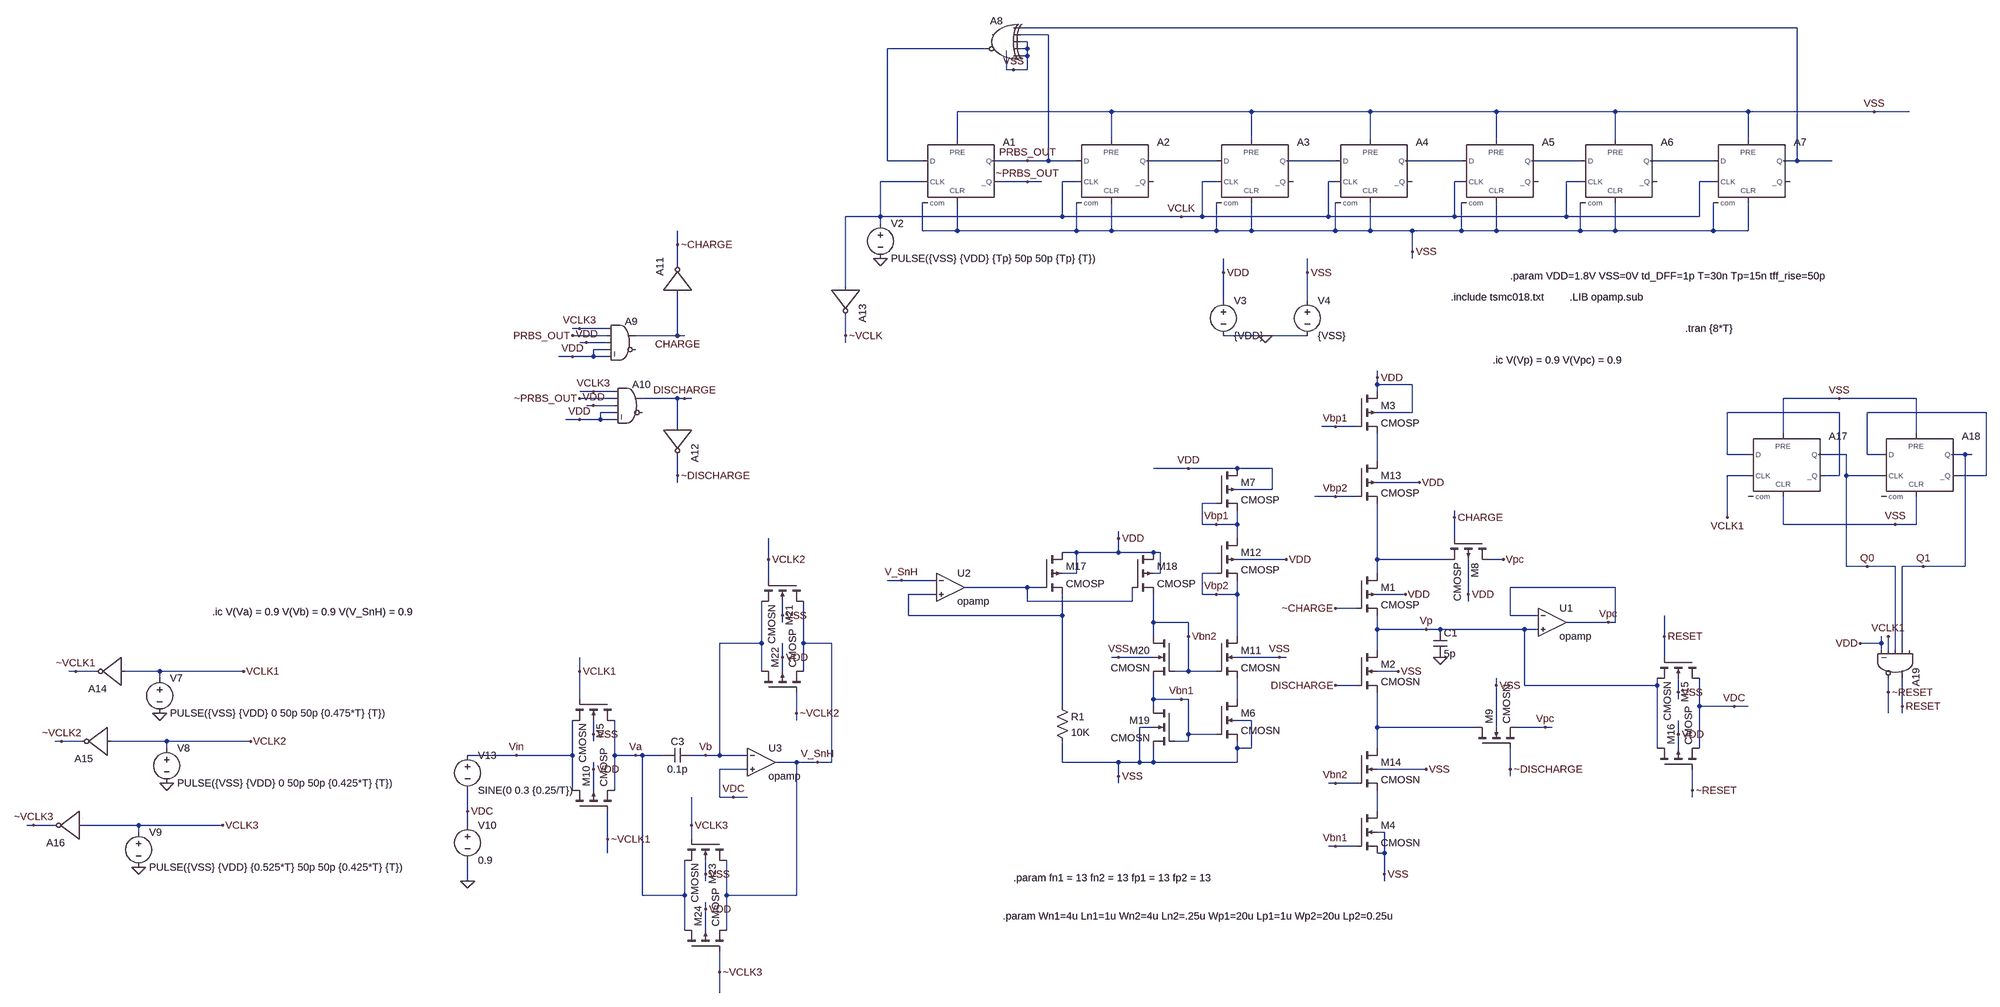
[diagram p0: schematic Current_Mode_Integrator1_2.asc]
Current_Mode_Integrator1_2.asc, the LTspice schematic file:
Version 4
SHEET 1 2280 2092
WIRE 1520 -160 -256 -160
WIRE -192 -144 -256 -144
WIRE -240 -128 -256 -128
WIRE -336 -112 -560 -112
WIRE -240 -112 -240 -128
WIRE -240 -112 -256 -112
WIRE -240 -96 -240 -112
WIRE -240 -96 -256 -96
WIRE -288 -64 -288 -96
WIRE -272 -64 -288 -64
WIRE -240 -64 -240 -96
WIRE -240 -64 -272 -64
WIRE -48 32 -400 32
WIRE 272 32 -48 32
WIRE 544 32 272 32
WIRE 832 32 544 32
WIRE 1104 32 832 32
WIRE 1408 32 1104 32
WIRE 1696 32 1408 32
WIRE 1776 32 1696 32
WIRE -400 96 -400 32
WIRE -48 96 -48 32
WIRE 272 96 272 32
WIRE 544 96 544 32
WIRE 832 96 832 32
WIRE 1104 96 1104 32
WIRE 1408 96 1408 32
WIRE -560 144 -560 -112
WIRE -480 144 -560 144
WIRE -240 144 -320 144
WIRE -192 144 -192 -144
WIRE -192 144 -240 144
WIRE -128 144 -192 144
WIRE 192 144 32 144
WIRE 464 144 352 144
WIRE 752 144 624 144
WIRE 1024 144 912 144
WIRE 1328 144 1184 144
WIRE 1520 144 1520 -160
WIRE 1520 144 1488 144
WIRE 1600 144 1520 144
WIRE -480 192 -576 192
WIRE -240 192 -304 192
WIRE -208 192 -240 192
WIRE -128 192 -160 192
WIRE 192 192 160 192
WIRE 464 192 448 192
WIRE 752 192 736 192
WIRE 1024 192 992 192
WIRE 1328 192 1296 192
WIRE -576 272 -576 192
WIRE -576 272 -656 272
WIRE -160 272 -160 192
WIRE -160 272 -576 272
WIRE 112 272 -160 272
WIRE 160 272 160 192
WIRE 160 272 112 272
WIRE 448 272 448 192
WIRE 448 272 160 272
WIRE 736 272 736 192
WIRE 736 272 448 272
WIRE 992 272 992 192
WIRE 992 272 736 272
WIRE 1296 272 1296 192
WIRE 1296 272 992 272
WIRE -576 288 -576 272
WIRE -480 304 -480 240
WIRE -400 304 -400 240
WIRE -400 304 -480 304
WIRE -128 304 -128 240
WIRE -128 304 -400 304
WIRE -48 304 -48 240
WIRE -48 304 -128 304
WIRE 192 304 192 240
WIRE 192 304 -48 304
WIRE 272 304 272 240
WIRE 272 304 192 304
WIRE 464 304 464 240
WIRE 464 304 272 304
WIRE 544 304 544 240
WIRE 544 304 464 304
WIRE 640 304 544 304
WIRE 752 304 752 240
WIRE 752 304 640 304
WIRE 832 304 832 240
WIRE 832 304 752 304
WIRE 1024 304 1024 240
WIRE 1024 304 832 304
WIRE 1104 304 1104 240
WIRE 1104 304 1024 304
WIRE 1328 304 1328 240
WIRE 1328 304 1104 304
WIRE 1408 304 1408 240
WIRE 1408 304 1328 304
WIRE -1040 336 -1040 304
WIRE 640 352 640 304
WIRE 640 368 640 352
WIRE -1040 384 -1040 336
WIRE 208 400 208 368
WIRE 400 400 400 368
WIRE -656 432 -656 272
WIRE 208 464 208 400
WIRE 400 464 400 400
WIRE -1264 528 -1280 528
WIRE -1200 528 -1264 528
WIRE -1200 544 -1280 544
WIRE -1040 544 -1040 448
WIRE -1040 544 -1136 544
WIRE -1024 544 -1040 544
WIRE -656 544 -656 496
WIRE 304 544 208 544
WIRE 400 544 304 544
WIRE -1248 560 -1264 560
WIRE -1200 560 -1248 560
WIRE -656 560 -656 544
WIRE -1200 576 -1232 576
WIRE -1280 592 -1312 592
WIRE -1232 592 -1232 576
WIRE -1232 592 -1280 592
WIRE -1200 592 -1232 592
WIRE 560 640 560 624
WIRE 560 656 560 640
WIRE 640 656 560 656
WIRE -1232 672 -1264 672
WIRE -1184 672 -1232 672
WIRE 560 672 560 656
WIRE -1184 688 -1264 688
WIRE -1040 688 -1120 688
WIRE -1024 688 -1040 688
WIRE -1008 688 -1024 688
WIRE 1616 688 1488 688
WIRE 1792 688 1616 688
WIRE -1232 704 -1248 704
WIRE -1184 704 -1232 704
WIRE -1184 720 -1216 720
WIRE 640 720 640 656
WIRE 640 720 560 720
WIRE 1616 720 1360 720
WIRE 1952 720 1680 720
WIRE -1264 736 -1296 736
WIRE -1216 736 -1216 720
WIRE -1216 736 -1264 736
WIRE -1184 736 -1216 736
WIRE -1040 752 -1040 688
WIRE 464 752 432 752
WIRE 512 752 464 752
WIRE 1488 768 1488 688
WIRE 1792 768 1792 688
WIRE 1360 816 1360 720
WIRE 1408 816 1360 816
WIRE 1632 816 1568 816
WIRE 1680 816 1680 720
WIRE 1712 816 1680 816
WIRE 1904 816 1872 816
WIRE 1920 816 1904 816
WIRE 560 832 560 768
WIRE 128 848 48 848
WIRE 240 848 128 848
WIRE 320 848 240 848
WIRE -1040 864 -1040 816
WIRE 1408 864 1360 864
WIRE 1616 864 1616 720
WIRE 1616 864 1584 864
WIRE 1632 864 1632 816
WIRE 1712 864 1632 864
WIRE 1952 864 1952 720
WIRE 1952 864 1888 864
WIRE -1040 880 -1040 864
WIRE 656 880 560 880
WIRE 320 896 320 848
WIRE 320 896 240 896
WIRE 464 912 416 912
WIRE 512 912 464 912
WIRE 192 928 160 928
WIRE 736 960 736 944
WIRE 1360 960 1360 864
WIRE 160 976 160 928
WIRE 192 976 160 976
WIRE 240 976 240 944
WIRE 240 976 192 976
WIRE 1488 976 1488 912
WIRE 1744 976 1488 976
WIRE 1792 976 1792 912
WIRE 1792 976 1744 976
WIRE -32 1008 -32 992
WIRE 240 1008 240 976
WIRE 736 1008 736 960
WIRE -128 1040 -160 1040
WIRE -32 1040 -32 1008
WIRE -32 1040 -128 1040
WIRE 48 1040 -32 1040
WIRE 64 1040 48 1040
WIRE -832 1056 -832 1008
WIRE 352 1056 240 1056
WIRE 560 1056 560 928
WIRE 720 1056 560 1056
WIRE 848 1056 816 1056
WIRE 1632 1072 1632 864
WIRE 1680 1072 1632 1072
WIRE 1744 1072 1680 1072
WIRE 1808 1072 1760 1072
WIRE 1904 1072 1904 816
WIRE 1904 1072 1808 1072
WIRE -128 1088 -128 1040
WIRE -128 1088 -160 1088
WIRE 64 1088 64 1040
WIRE 64 1088 48 1088
WIRE 192 1088 160 1088
WIRE 560 1088 560 1056
WIRE -832 1104 -832 1056
WIRE -528 1104 -560 1104
WIRE -448 1104 -528 1104
WIRE -240 1120 -384 1120
WIRE -208 1120 -240 1120
WIRE 1104 1120 864 1120
WIRE -448 1136 -512 1136
WIRE 160 1136 160 1088
WIRE 192 1136 160 1136
WIRE 240 1136 240 1104
WIRE 240 1136 192 1136
WIRE 624 1136 560 1136
WIRE 768 1136 768 1056
WIRE -240 1152 -240 1120
WIRE 0 1152 0 1120
WIRE 0 1152 -240 1152
WIRE 768 1152 768 1136
WIRE 512 1168 464 1168
WIRE -800 1184 -800 1152
WIRE -512 1184 -512 1136
WIRE -160 1184 -160 1136
WIRE -160 1184 -512 1184
WIRE 864 1184 864 1120
WIRE 928 1184 864 1184
WIRE -800 1200 -800 1184
WIRE 48 1200 48 1136
WIRE 128 1200 48 1200
WIRE 1088 1200 992 1200
WIRE 1104 1200 1104 1120
WIRE 1104 1200 1088 1200
WIRE 560 1216 560 1184
WIRE 672 1216 560 1216
WIRE 704 1216 672 1216
WIRE 896 1216 704 1216
WIRE 928 1216 896 1216
WIRE 48 1232 48 1200
WIRE 128 1232 128 1200
WIRE 240 1232 240 1136
WIRE 1216 1232 1216 1184
WIRE -848 1248 -848 1152
WIRE -848 1248 -944 1248
WIRE -752 1248 -752 1152
WIRE -688 1248 -752 1248
WIRE 1712 1248 1712 1232
WIRE 1712 1248 1664 1248
WIRE 560 1264 560 1216
WIRE 1712 1264 1712 1248
WIRE 1728 1264 1728 1232
WIRE 1744 1264 1744 1072
WIRE 1760 1264 1760 1072
WIRE -800 1280 -800 1248
WIRE -32 1280 -48 1280
WIRE 48 1280 -32 1280
WIRE 336 1280 240 1280
WIRE 352 1280 336 1280
WIRE 1216 1280 1216 1232
WIRE -2416 1312 -2432 1312
WIRE -2368 1312 -2416 1312
WIRE -2224 1312 -2304 1312
WIRE -2032 1312 -2224 1312
WIRE -1264 1312 -1264 1280
WIRE -848 1312 -848 1248
WIRE -800 1312 -800 1280
WIRE -752 1312 -752 1248
WIRE 128 1312 128 1232
WIRE 128 1312 96 1312
WIRE 192 1312 128 1312
WIRE 608 1312 560 1312
WIRE -2224 1328 -2224 1312
WIRE 512 1344 464 1344
WIRE 832 1344 832 1328
WIRE 896 1344 896 1216
WIRE 1200 1344 1200 1328
WIRE 1200 1344 896 1344
WIRE 1248 1360 1248 1328
WIRE 1728 1360 1728 1328
WIRE -1264 1376 -1264 1312
WIRE 48 1376 48 1328
WIRE 112 1376 48 1376
WIRE 128 1376 112 1376
WIRE 240 1376 240 1328
WIRE 1248 1376 1248 1360
WIRE -160 1392 -160 1184
WIRE 48 1392 48 1376
WIRE 1296 1392 1296 1328
WIRE 1376 1392 1296 1392
WIRE 1408 1392 1376 1392
WIRE 1760 1392 1760 1328
WIRE -768 1408 -768 1360
WIRE 1728 1408 1728 1360
WIRE 1760 1408 1760 1392
WIRE -768 1424 -768 1408
WIRE 272 1424 240 1424
WIRE 48 1440 16 1440
WIRE 560 1440 560 1360
WIRE 784 1440 560 1440
WIRE 832 1440 832 1344
WIRE 944 1440 880 1440
WIRE 960 1440 944 1440
WIRE -1232 1456 -1232 1424
WIRE 128 1456 128 1376
WIRE 192 1456 128 1456
WIRE 1248 1456 1248 1424
WIRE -2448 1472 -2464 1472
WIRE -2400 1472 -2448 1472
WIRE -2208 1472 -2336 1472
WIRE -2016 1472 -2208 1472
WIRE -1232 1472 -1232 1456
WIRE 128 1472 128 1456
WIRE 128 1472 96 1472
WIRE -2208 1488 -2208 1472
WIRE 240 1488 240 1472
WIRE 272 1488 272 1424
WIRE 272 1488 240 1488
WIRE 560 1488 560 1440
WIRE 1200 1488 1200 1344
WIRE 1248 1488 1248 1456
WIRE 1296 1488 1296 1392
WIRE -1408 1504 -1520 1504
WIRE -1280 1504 -1280 1424
WIRE -1280 1504 -1408 1504
WIRE -1184 1504 -1184 1424
WIRE -1136 1504 -1184 1504
WIRE -1120 1504 -1136 1504
WIRE -1072 1504 -1120 1504
WIRE -976 1504 -1008 1504
WIRE -944 1504 -944 1248
WIRE -944 1504 -976 1504
WIRE -880 1504 -944 1504
WIRE -768 1520 -816 1520
WIRE -720 1520 -768 1520
WIRE -688 1520 -688 1248
WIRE -688 1520 -720 1520
WIRE -160 1520 -160 1472
WIRE -32 1520 -160 1520
WIRE 16 1520 16 1440
WIRE 16 1520 -32 1520
WIRE 48 1520 48 1488
WIRE 48 1520 16 1520
WIRE 240 1520 240 1488
WIRE 240 1520 48 1520
WIRE -1232 1536 -1232 1520
WIRE -880 1536 -944 1536
WIRE 672 1536 560 1536
WIRE 864 1536 864 1488
WIRE -32 1552 -32 1520
WIRE 864 1552 864 1536
WIRE -32 1568 -32 1552
WIRE 464 1568 448 1568
WIRE 512 1568 464 1568
WIRE -1280 1584 -1280 1504
WIRE -1232 1584 -1232 1536
WIRE -1184 1584 -1184 1504
WIRE 1280 1584 1280 1536
WIRE -944 1600 -944 1536
WIRE -912 1600 -944 1600
WIRE -880 1600 -912 1600
WIRE 1280 1600 1280 1584
WIRE -1520 1632 -1520 1584
WIRE 560 1632 560 1584
WIRE -2512 1664 -2528 1664
WIRE -2464 1664 -2512 1664
WIRE -2272 1664 -2400 1664
WIRE -2080 1664 -2272 1664
WIRE -1520 1664 -1520 1632
WIRE -1008 1664 -1008 1600
WIRE -2272 1680 -2272 1664
WIRE 576 1680 560 1680
WIRE -1200 1696 -1200 1632
WIRE -1008 1696 -1008 1664
WIRE 464 1712 448 1712
WIRE 512 1712 464 1712
WIRE -1200 1728 -1200 1696
WIRE 576 1728 576 1680
WIRE 576 1728 560 1728
WIRE -976 1776 -976 1744
WIRE 576 1776 576 1728
WIRE -1520 1792 -1520 1744
WIRE -976 1792 -976 1776
WIRE 576 1792 576 1776
WIRE -1120 1824 -1120 1504
WIRE -1024 1824 -1024 1744
WIRE -1024 1824 -1120 1824
WIRE -928 1824 -928 1744
WIRE -768 1824 -768 1520
WIRE -768 1824 -928 1824
WIRE -976 1856 -976 1840
WIRE -1024 1904 -1024 1824
WIRE -976 1904 -976 1856
WIRE -928 1904 -928 1824
WIRE -944 2000 -944 1952
WIRE -944 2048 -944 2000
FLAG -576 368 0
FLAG -272 -64 VSS
FLAG 640 352 VSS
FLAG -240 144 PRBS_OUT
FLAG -240 192 ~PRBS_OUT
FLAG 304 544 0
FLAG 208 400 VDD
FLAG 400 400 VSS
FLAG 704 1280 0
FLAG 560 640 VDD
FLAG 672 1216 Vp
FLAG 1088 1200 Vpc
FLAG 624 1136 VDD
FLAG 608 1312 VSS
FLAG 944 1440 Vpc
FLAG 736 960 CHARGE
FLAG 864 1536 ~DISCHARGE
FLAG 848 1056 Vpc
FLAG 1696 32 VSS
FLAG 112 272 VCLK
FLAG 128 848 VDD
FLAG 192 976 Vbp1
FLAG 464 752 Vbp1
FLAG 464 1712 Vbn1
FLAG 768 1136 VDD
FLAG 832 1344 VSS
FLAG 576 1776 VSS
FLAG 336 1280 VSS
FLAG 352 1056 VDD
FLAG 192 1136 Vbp2
FLAG 464 912 Vbp2
FLAG 656 880 VDD
FLAG 464 1568 Vbn2
FLAG 672 1536 VSS
FLAG -32 1008 VDD
FLAG -32 1552 VSS
FLAG 112 1376 Vbn1
FLAG -32 1280 VSS
FLAG 128 1232 Vbn2
FLAG -528 1104 V_SnH
FLAG -1280 544 PRBS_OUT
FLAG -1040 544 CHARGE
FLAG -1248 560 VDD
FLAG -1280 592 VDD
FLAG -1264 688 ~PRBS_OUT
FLAG -1024 688 DISCHARGE
FLAG -1232 704 VDD
FLAG -1264 736 VDD
FLAG -1264 528 VCLK3
FLAG -1232 672 VCLK3
FLAG -1040 336 ~CHARGE
FLAG -1040 864 ~DISCHARGE
FLAG 464 1168 ~CHARGE
FLAG 464 1344 DISCHARGE
FLAG -656 544 ~VCLK
FLAG -2224 1408 0
FLAG -2416 1312 ~VCLK1
FLAG -2032 1312 VCLK1
FLAG -2208 1568 0
FLAG -2016 1472 VCLK2
FLAG -2272 1760 0
FLAG -2080 1664 VCLK3
FLAG -2448 1472 ~VCLK2
FLAG -2512 1664 ~VCLK3
FLAG -1520 1792 0
FLAG -1520 1632 VDC
FLAG -1232 1536 VDD
FLAG -976 1856 VDD
FLAG -800 1280 VDD
FLAG -800 1184 VSS
FLAG -976 1776 VSS
FLAG -1232 1456 VSS
FLAG -1264 1312 VCLK1
FLAG -1200 1696 ~VCLK1
FLAG -1008 1664 VCLK3
FLAG -944 2000 ~VCLK3
FLAG -832 1056 VCLK2
FLAG -768 1408 ~VCLK2
FLAG -720 1520 V_SnH
FLAG -1136 1504 Va
FLAG -976 1504 Vb
FLAG -1408 1504 Vin
FLAG 1248 1456 VDD
FLAG 1248 1360 VSS
FLAG 1216 1232 RESET
FLAG 1280 1584 ~RESET
FLAG -912 1600 VDC
FLAG 1376 1392 VDC
FLAG 1360 960 VCLK1
FLAG 1744 976 VSS
FLAG 1616 688 VSS
FLAG 1680 1072 Q0
FLAG 1808 1072 Q1
FLAG 1664 1248 VDD
FLAG 1760 1392 RESET
FLAG 1728 1360 ~RESET
FLAG 1728 1232 VCLK1
SYMBOL Digital\\dflop -400 96 R0
SYMATTR InstName A1
SYMATTR SpiceLine Trise = {tff_rise} Tfall = {tff_rise} Td = td_DFF
SYMATTR Value2 Vhigh = 1.8 Vlow = 0
SYMBOL Digital\\dflop -48 96 R0
SYMATTR InstName A2
SYMATTR SpiceLine Trise = {tff_rise} Tfall = {tff_rise} Td = td_DFF
SYMATTR Value2 Vhigh = 1.8 Vlow = 0
SYMBOL Digital\\dflop 272 96 R0
SYMATTR InstName A3
SYMATTR SpiceLine Trise = {tff_rise} Tfall = {tff_rise} Td = td_DFF
SYMATTR Value2 Vhigh = 1.8 Vlow = 0
SYMBOL Digital\\dflop 544 96 R0
SYMATTR InstName A4
SYMATTR SpiceLine Trise = {tff_rise} Tfall = {tff_rise} Td = td_DFF
SYMATTR Value2 Vhigh = 1.8 Vlow = 0
SYMBOL Digital\\dflop 832 96 R0
SYMATTR InstName A5
SYMATTR SpiceLine Trise = {tff_rise} Tfall = {tff_rise} Td = td_DFF
SYMATTR Value2 Vhigh = 1.8 Vlow = 0
SYMBOL Digital\\dflop 1104 96 R0
SYMATTR InstName A6
SYMATTR SpiceLine Trise = {tff_rise} Tfall = {tff_rise} Td = td_DFF
SYMATTR Value2 Vhigh = 1.8 Vlow = 0
SYMBOL Digital\\dflop 1408 96 R0
SYMATTR InstName A7
SYMATTR SpiceLine Trise = {tff_rise} Tfall = {tff_rise} Td = td_DFF
SYMATTR Value2 Vhigh = 1.8 Vlow = 0
SYMBOL Digital\\xor -304 -192 M0
SYMATTR InstName A8
SYMATTR Value2 Vhigh = 1.8 Vlow = 0
SYMBOL voltage -576 272 R0
WINDOW 123 0 0 Left 0
WINDOW 39 0 0 Left 0
SYMATTR InstName V2
SYMATTR Value PULSE({VSS} {VDD} {Tp} 50p 50p {Tp} {T})
SYMBOL voltage 208 448 R0
WINDOW 123 0 0 Left 0
WINDOW 39 0 0 Left 0
SYMATTR InstName V3
SYMATTR Value {VDD}
SYMBOL voltage 400 448 R0
WINDOW 123 0 0 Left 0
WINDOW 39 0 0 Left 0
SYMATTR InstName V4
SYMATTR Value {VSS}
SYMBOL pmos4 512 1088 R0
SYMATTR InstName M1
SYMATTR Value CMOSP
SYMATTR Value2 l=0.5u w=6u
SYMBOL nmos4 512 1264 R0
SYMATTR InstName M2
SYMATTR Value CMOSN
SYMATTR Value2 l=.5u w=6u
SYMBOL cap 688 1216 R0
SYMATTR InstName C1
SYMATTR Value 5p
SYMBOL Opamps\\opamp 960 1136 R0
SYMATTR InstName U1
SYMATTR SpiceLine2 GBW=1000Meg
SYMBOL nmos4 192 1376 R0
SYMATTR InstName M6
SYMATTR Value CMOSN
SYMATTR Value2 l={Ln1} w={Wn1} m={fn1}
SYMBOL pmos4 192 848 R0
SYMATTR InstName M7
SYMATTR Value CMOSP
SYMATTR Value2 l={Lp1} w={Wp1} m={fp1}
SYMBOL nmos4 512 1632 R0
SYMATTR InstName M4
SYMATTR Value CMOSN
SYMATTR Value2 l={Ln1} w={Wn1} m={fn1}
SYMBOL pmos4 816 1008 R90
SYMATTR InstName M8
SYMATTR Value CMOSP
SYMATTR Value2 l=.5u w=6u
SYMBOL nmos4 784 1488 R270
SYMATTR InstName M9
SYMATTR Value CMOSN
SYMATTR Value2 l=.5u w=6u
SYMBOL pmos4 512 672 R0
SYMATTR InstName M3
SYMATTR Value CMOSP
SYMATTR Value2 l={Lp1} w={Wp1} m={fp1}
SYMBOL nmos4 192 1232 R0
SYMATTR InstName M11
SYMATTR Value CMOSN
SYMATTR Value2 l={Ln2} w={Wn2} m={fn2}
SYMBOL pmos4 192 1008 R0
SYMATTR InstName M12
SYMATTR Value CMOSP
SYMATTR Value2 l={Lp2} w={Wp2} m={fp2}
SYMBOL pmos4 512 832 R0
SYMATTR InstName M13
SYMATTR Value CMOSP
SYMATTR Value2 l={Lp2} w={Wp2} m={fp2}
SYMBOL nmos4 512 1488 R0
SYMATTR InstName M14
SYMATTR Value CMOSN
SYMATTR Value2 l={Ln2} w={Wn2} m={fn2}
SYMBOL pmos4 -208 1040 R0
SYMATTR InstName M17
SYMATTR Value CMOSP
SYMATTR Value2 l=1u w=6u
SYMBOL res -176 1376 R0
SYMATTR InstName R1
SYMATTR Value 10K
SYMBOL pmos4 0 1040 R0
SYMATTR InstName M18
SYMATTR Value CMOSP
SYMATTR Value2 l=1u w=6u
SYMBOL nmos4 96 1392 M0
SYMATTR InstName M19
SYMATTR Value CMOSN
SYMATTR Value2 l={Ln1} w={Wn1} m={fn1}
SYMBOL Opamps\\opamp -416 1056 R0
SYMATTR InstName U2
SYMATTR SpiceLine2 GBW=200Meg
SYMBOL nmos4 96 1232 M0
SYMATTR InstName M20
SYMATTR Value CMOSN
SYMATTR Value2 l={Ln2} w={Wn2} m={fn2}
SYMBOL Digital\\and -1168 496 R0
SYMATTR InstName A9
SYMATTR Value2 Vhigh = 1.8 Vlow = 0
SYMATTR SpiceLine Trise = {tff_rise} Tfall = {tff_rise} Td = td_DFF
SYMBOL Digital\\and -1152 640 R0
SYMATTR InstName A10
SYMATTR Value2 Vhigh = 1.8 Vlow = 0
SYMATTR SpiceLine Trise = {tff_rise} Tfall = {tff_rise} Td = td_DFF
SYMBOL Digital\\inv -1104 448 R270
SYMATTR InstName A11
SYMATTR SpiceLine Trise = {tff_rise} Tfall = {tff_rise} Td = td_DFF
SYMATTR Value2 Vhigh = 1.8 Vlow = 0
SYMBOL Digital\\inv -976 752 R90
SYMATTR InstName A12
SYMATTR Value2 Vhigh = 1.8 Vlow = 0
SYMATTR SpiceLine Trise = {tff_rise} Tfall = {tff_rise} Td = td_DFF
SYMBOL Digital\\inv -592 432 R90
SYMATTR InstName A13
SYMATTR Value2 Vhigh = 1.8 Vlow = 0
SYMATTR SpiceLine Trise = {tff_rise} Tfall = {tff_rise} Td = td_DFF
SYMBOL voltage -2224 1312 R0
WINDOW 123 0 0 Left 0
WINDOW 39 0 0 Left 0
SYMATTR InstName V7
SYMATTR Value PULSE({VSS} {VDD} 0 50p 50p {0.475*T} {T})
SYMBOL Digital\\inv -2304 1376 R180
SYMATTR InstName A14
SYMATTR Value2 Vhigh = 1.8 Vlow = 0
SYMATTR SpiceLine Trise = {tff_rise} Tfall = {tff_rise} Td = td_DFF
SYMBOL voltage -2208 1472 R0
WINDOW 123 0 0 Left 0
WINDOW 39 0 0 Left 0
SYMATTR InstName V8
SYMATTR Value PULSE({VSS} {VDD} 0 50p 50p {0.425*T} {T})
SYMBOL voltage -2272 1664 R0
WINDOW 123 0 0 Left 0
WINDOW 39 0 0 Left 0
SYMATTR InstName V9
SYMATTR Value PULSE({VSS} {VDD} {0.525*T} 50p 50p {0.425*T} {T})
SYMBOL voltage -1520 1648 R0
WINDOW 123 0 0 Left 0
WINDOW 39 0 0 Left 0
SYMATTR InstName V10
SYMATTR Value 0.9
SYMBOL nmos4 -1184 1376 R90
SYMATTR InstName M5
SYMATTR Value CMOSN
SYMATTR Value2 l=1u w=4u
SYMBOL pmos4 -1280 1632 R270
SYMATTR InstName M10
SYMATTR Value CMOSP
SYMATTR Value2 l=1u w=4u
SYMBOL Digital\\inv -2336 1536 R180
SYMATTR InstName A15
SYMATTR Value2 Vhigh = 1.8 Vlow = 0
SYMATTR SpiceLine Trise = {tff_rise} Tfall = {tff_rise} Td = td_DFF
SYMBOL Digital\\inv -2400 1728 R180
SYMATTR InstName A16
SYMATTR Value2 Vhigh = 1.8 Vlow = 0
SYMATTR SpiceLine Trise = {tff_rise} Tfall = {tff_rise} Td = td_DFF
SYMBOL cap -1008 1488 R90
WINDOW 0 0 32 VBottom 2
WINDOW 3 32 32 VTop 2
SYMATTR InstName C3
SYMATTR Value 0.1p
SYMBOL Opamps\\opamp -848 1456 R0
SYMATTR InstName U3
SYMATTR SpiceLine2 GBW=300Meg
SYMBOL nmos4 -752 1104 R90
SYMATTR InstName M21
SYMATTR Value CMOSN
SYMATTR Value2 l=1u w=4u
SYMBOL pmos4 -848 1360 R270
SYMATTR InstName M22
SYMATTR Value CMOSP
SYMATTR Value2 l=1u w=4u
SYMBOL nmos4 -928 1696 R90
SYMATTR InstName M23
SYMATTR Value CMOSN
SYMATTR Value2 l=1u w=4u
SYMBOL pmos4 -1024 1952 R270
SYMATTR InstName M24
SYMATTR Value CMOSP
SYMATTR Value2 l=1u w=4u
SYMBOL voltage -1520 1488 R0
WINDOW 123 0 0 Left 0
WINDOW 39 0 0 Left 0
SYMATTR InstName V13
SYMATTR Value SINE(0 0.3 {0.25/T})
SYMBOL nmos4 1296 1280 R90
SYMATTR InstName M15
SYMATTR Value CMOSN
SYMATTR Value2 l=1u w=4u m=3
SYMBOL pmos4 1200 1536 R270
SYMATTR InstName M16
SYMATTR Value CMOSP
SYMATTR Value2 l=1u w=4u m=3
SYMBOL Digital\\dflop 1488 768 R0
SYMATTR InstName A17
SYMATTR SpiceLine Trise = {tff_rise} Tfall = {tff_rise} Td = td_DFF
SYMATTR Value2 Vhigh = 1.8 Vlow = 0
SYMBOL Digital\\dflop 1792 768 R0
SYMATTR InstName A18
SYMATTR SpiceLine Trise = {tff_rise} Tfall = {tff_rise} Td = td_DFF
SYMATTR Value2 Vhigh = 1.8 Vlow = 0
SYMBOL Digital\\and 1808 1296 R90
SYMATTR InstName A19
SYMATTR SpiceLine Trise = {tff_rise} Tfall = {tff_rise} Td = td_DFF
SYMATTR Value2 Vhigh = 1.8 Vlow = 0
TEXT 864 408 Left 2 !.param VDD=1.8V VSS=0V td_DFF=1p T=30n Tp=15n tff_rise=50p
TEXT 824 600 Left 2 !.ic V(Vp) = 0.9 V(Vpc) = 0.9
TEXT 728 456 Left 2 !.include tsmc018.txt
TEXT 1264 528 Left 2 !.tran {8*T}
TEXT 1000 456 Left 2 !.LIB opamp.sub
TEXT -296 1872 Left 2 !.param Wn1=4u Ln1=1u Wn2=4u Ln2=.25u Wp1=20u Lp1=1u Wp2=20u Lp2=0.25u
TEXT -272 1784 Left 2 !.param fn1 = 13 fn2 = 13 fp1 = 13 fp2 = 13
TEXT -2104 1176 Left 2 !.ic V(Va) = 0.9 V(Vb) = 0.9 V(V_SnH) = 0.9

The netlist it stands for:
* Current_Mode_Integrator1_2.asc
A1 N002 VSS VCLK VSS VSS ~PRBS_OUT PRBS_OUT VSS DFLOP Vhigh = 1.8 Vlow = 0 Trise = {tff_rise} Tfall = {tff_rise} Td = td_DFF
A2 PRBS_OUT VSS VCLK VSS VSS VSS N003 VSS DFLOP Vhigh = 1.8 Vlow = 0 Trise = {tff_rise} Tfall = {tff_rise} Td = td_DFF
A3 N003 VSS VCLK VSS VSS VSS N004 VSS DFLOP Vhigh = 1.8 Vlow = 0 Trise = {tff_rise} Tfall = {tff_rise} Td = td_DFF
A4 N004 VSS VCLK VSS VSS VSS N005 VSS DFLOP Vhigh = 1.8 Vlow = 0 Trise = {tff_rise} Tfall = {tff_rise} Td = td_DFF
A5 N005 VSS VCLK VSS VSS VSS N006 VSS DFLOP Vhigh = 1.8 Vlow = 0 Trise = {tff_rise} Tfall = {tff_rise} Td = td_DFF
A6 N006 VSS VCLK VSS VSS VSS N007 VSS DFLOP Vhigh = 1.8 Vlow = 0 Trise = {tff_rise} Tfall = {tff_rise} Td = td_DFF
A7 N007 VSS VCLK VSS VSS VSS N001 VSS DFLOP Vhigh = 1.8 Vlow = 0 Trise = {tff_rise} Tfall = {tff_rise} Td = td_DFF
A8 N001 PRBS_OUT VSS VSS VSS N002 VSS VSS XOR Vhigh = 1.8 Vlow = 0
V2 VCLK 0 PULSE({VSS} {VDD} {Tp} 50p 50p {Tp} {T})
V3 VDD 0 {VDD}
V4 VSS 0 {VSS}
M1 N011 ~CHARGE Vp VDD CMOSP l=0.5u w=6u
M2 Vp DISCHARGE N015 VSS CMOSN l=.5u w=6u
C1 Vp 0 5p
XU1 Vpc Vp Vpc opamp Aol=100K GBW=1000Meg  ; pins invin noninvin out
M6 N014 Vbn1 VSS VSS CMOSN l={Ln1} w={Wn1} m={fn1}
M7 VDD Vbp1 Vbp1 VDD CMOSP l={Lp1} w={Wp1} m={fp1}
M4 N016 Vbn1 VSS VSS CMOSN l={Ln1} w={Wn1} m={fn1}
M8 Vpc CHARGE N011 VDD CMOSP l=.5u w=6u
M9 N015 ~DISCHARGE Vpc VSS CMOSN l=.5u w=6u
M3 VDD Vbp1 N010 VDD CMOSP l={Lp1} w={Wp1} m={fp1}
M11 Vbp2 Vbn2 N014 VSS CMOSN l={Ln2} w={Wn2} m={fn2}
M12 Vbp1 Vbp2 Vbp2 VDD CMOSP l={Lp2} w={Wp2} m={fp2}
M13 N010 Vbp2 N011 VDD CMOSP l={Lp2} w={Wp2} m={fp2}
M14 N015 Vbn2 N016 VSS CMOSN l={Ln2} w={Wn2} m={fn2}
M17 VDD N012 N013 VDD CMOSP l=1u w=6u
R1 N013 VSS 10K
M18 VDD N012 Vbn2 VDD CMOSP l=1u w=6u
M19 Vbn1 Vbn1 VSS VSS CMOSN l={Ln1} w={Wn1} m={fn1}
XU2 V_SnH N013 N012 opamp Aol=100K GBW=200Meg  ; pins invin noninvin out
M20 Vbn2 Vbn2 Vbn1 VSS CMOSN l={Ln2} w={Wn2} m={fn2}
A9 VCLK3 PRBS_OUT VDD VDD VDD 0 CHARGE 0 AND Vhigh = 1.8 Vlow = 0 Trise = {tff_rise} Tfall = {tff_rise} Td = td_DFF
A10 VCLK3 ~PRBS_OUT VDD VDD VDD 0 DISCHARGE 0 AND Vhigh = 1.8 Vlow = 0 Trise = {tff_rise} Tfall = {tff_rise} Td = td_DFF
A11 CHARGE 0 0 0 0 ~CHARGE 0 0 BUF Vhigh = 1.8 Vlow = 0 Trise = {tff_rise} Tfall = {tff_rise} Td = td_DFF
A12 DISCHARGE 0 0 0 0 ~DISCHARGE 0 0 BUF Vhigh = 1.8 Vlow = 0 Trise = {tff_rise} Tfall = {tff_rise} Td = td_DFF
A13 VCLK 0 0 0 0 ~VCLK 0 0 BUF Vhigh = 1.8 Vlow = 0 Trise = {tff_rise} Tfall = {tff_rise} Td = td_DFF
V7 VCLK1 0 PULSE({VSS} {VDD} 0 50p 50p {0.475*T} {T})
A14 VCLK1 0 0 0 0 ~VCLK1 0 0 BUF Vhigh = 1.8 Vlow = 0 Trise = {tff_rise} Tfall = {tff_rise} Td = td_DFF
V8 VCLK2 0 PULSE({VSS} {VDD} 0 50p 50p {0.425*T} {T})
V9 VCLK3 0 PULSE({VSS} {VDD} {0.525*T} 50p 50p {0.425*T} {T})
V10 VDC 0 0.9
M5 Va VCLK1 Vin VSS CMOSN l=1u w=4u
M10 Vin ~VCLK1 Va VDD CMOSP l=1u w=4u
A15 VCLK2 0 0 0 0 ~VCLK2 0 0 BUF Vhigh = 1.8 Vlow = 0 Trise = {tff_rise} Tfall = {tff_rise} Td = td_DFF
A16 VCLK3 0 0 0 0 ~VCLK3 0 0 BUF Vhigh = 1.8 Vlow = 0 Trise = {tff_rise} Tfall = {tff_rise} Td = td_DFF
C3 Vb Va 0.1p
XU3 Vb VDC V_SnH opamp Aol=100K GBW=300Meg  ; pins invin noninvin out
M21 V_SnH VCLK2 Vb VSS CMOSN l=1u w=4u
M22 Vb ~VCLK2 V_SnH VDD CMOSP l=1u w=4u
M23 V_SnH VCLK3 Va VSS CMOSN l=1u w=4u
M24 Va ~VCLK3 V_SnH VDD CMOSP l=1u w=4u
V13 Vin VDC SINE(0 0.3 {0.25/T})
M15 VDC RESET Vp VSS CMOSN l=1u w=4u m=3
M16 Vp ~RESET VDC VDD CMOSP l=1u w=4u m=3
A17 N008 0 VCLK1 VSS VSS N008 Q0 0 DFLOP Vhigh = 1.8 Vlow = 0 Trise = {tff_rise} Tfall = {tff_rise} Td = td_DFF
A18 N009 0 Q0 VSS VSS N009 Q1 0 DFLOP Vhigh = 1.8 Vlow = 0 Trise = {tff_rise} Tfall = {tff_rise} Td = td_DFF
A19 0 Q1 Q0 VCLK1 VDD ~RESET RESET 0 AND Vhigh = 1.8 Vlow = 0 Trise = {tff_rise} Tfall = {tff_rise} Td = td_DFF
.model NMOS NMOS
.model PMOS PMOS
.lib standard.mos
.param VDD=1.8V VSS=0V td_DFF=1p T=30n Tp=15n tff_rise=50p
.ic V(Vp) = 0.9 V(Vpc) = 0.9
.include tsmc018.txt
.tran {8*T}
.LIB opamp.sub
.param Wn1=4u Ln1=1u Wn2=4u Ln2=.25u Wp1=20u Lp1=1u Wp2=20u Lp2=0.25u
.param fn1 = 13 fn2 = 13 fp1 = 13 fp2 = 13
.ic V(Va) = 0.9 V(Vb) = 0.9 V(V_SnH) = 0.9
.backanno
.end